# EAGLE design STorM32 NT logger micro v22g4 000 (EAGLE 7.5.0)
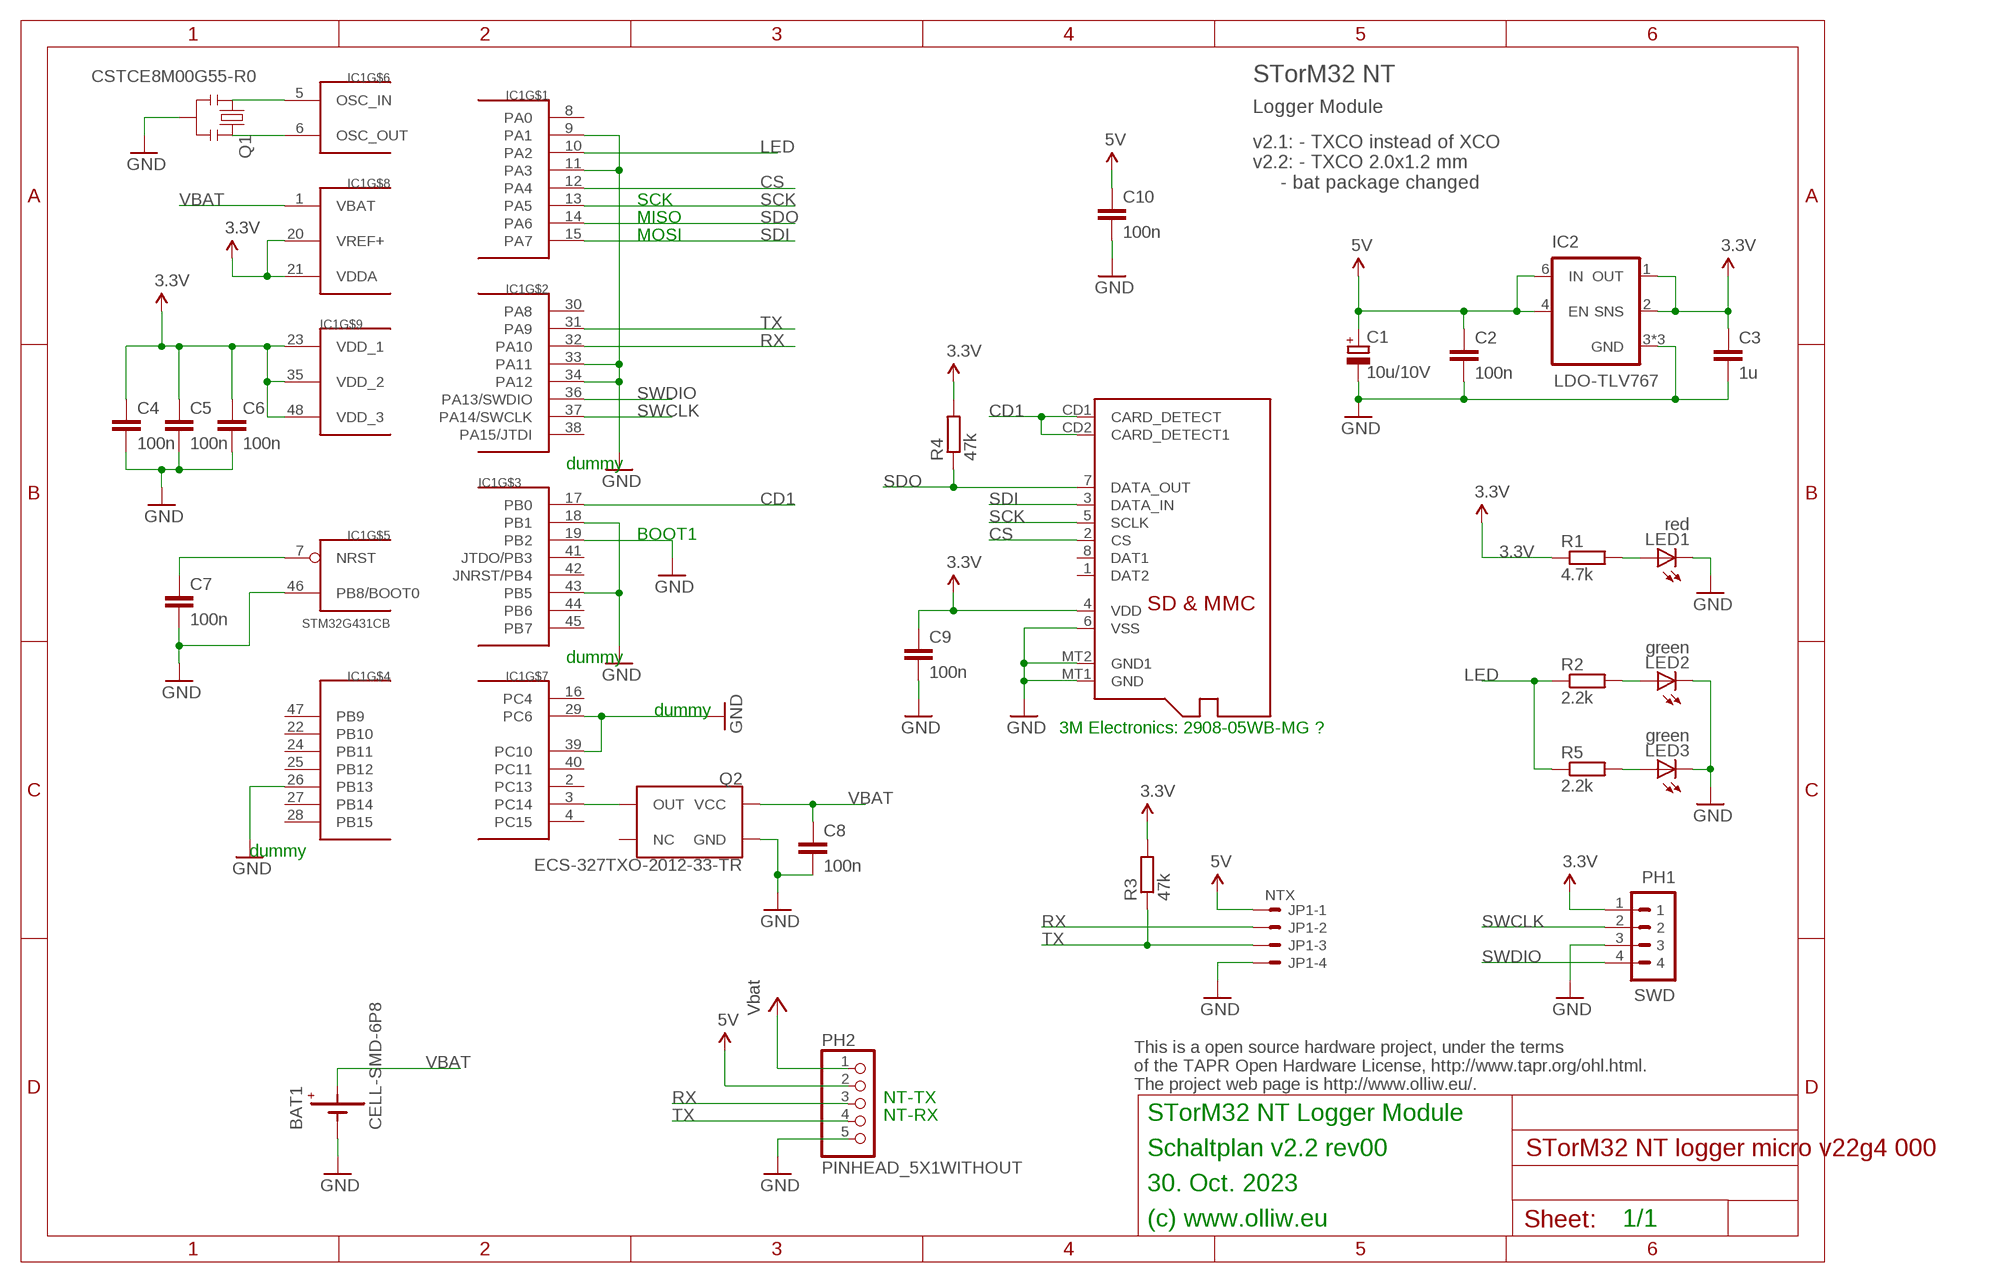
[diagram p0: schematic, sheet 1]

## Parts
BAT1  CELL-SMD-6P8  [CELL-RECHARGABLE-6P8]
C1  10u/10V  CPOL-EUSMCB  [SMC_B]
C2  100n  C-EUC0603  [C0603]
C3  1u  C-EUC0603  [C0603]
C4  100n  C-EUC0402  [C0402]
C5  100n  C-EUC0402  [C0402]
C6  100n  C-EUC0402  [C0402]
C7  100n  C-EUC0402  [C0402]
C8  100n  C-EUC0402  [C0402]
C9  100n  C-EUC0402  [C0402]
C10  100n  C-EUC0603  [C0603]
IC1  STM32G431CB  STM32G4X1CX  [UFQFPN48]
IC2  LDO-TLV767  [WSON-6-2X2]
JP1  NTX  SM04B-SRSS-TB  [SM04B-SRSS-TB]
LED1  red  LEDCHIPLED_0603  [CHIPLED_0603]
LED2  green  LEDCHIPLED_0603  [CHIPLED_0603]
LED3  green  LEDCHIPLED_0603  [CHIPLED_0603]
PH1  SWD  P4X1_1P27-OCT_BILEX  [4X1_1P27_OCT_BILEX]
PH2  PINHEAD_5X1WITHOUT  [PINHEAD_5X1_WO]
Q1  CSTCE8M00G55-R0  RESONATORSMD  [RESONATOR-SMD]
Q2  ECS-327TXO-2012-33-TR  TXCO-2.0X1.2MM  [TXCO-20X12]
R1  4.7k  R-EU_R0402  [R0402]
R2  2.2k  R-EU_R0402  [R0402]
R3  47k  R-EU_R0402  [R0402]
R4  47k  R-EU_R0402  [R0402]
R5  2.2k  R-EU_R0402  [R0402]
U1  3M 2908-05WB-MG ??  MICROSD  [MICROSD]

## Nets
3.3V: C3.1 C4.1 C5.1 C6.1 C9.1 IC1.20(VREF+) IC1.21(VDDA) IC1.23(VDD_1) IC1.35(VDD_2) IC1.48(VDD_3) IC2.1(OUT) IC2.2(SNS) PH1.1 R1.1 R3.2 R4.2 U1.4(VDD)
5V: C1.+ C2.1 C10.1 IC2.4(EN) IC2.6(IN) JP1.1 PH2.2
CD1: IC1.17(PB0) U1.CD1(CARD_DETECT) U1.CD2(CARD_DETECT1)
CS: IC1.12(PA4) U1.2(CS)
GND: BAT1.P-(GND) C1.- C2.2 C3.2 C4.2 C5.2 C6.2 C7.2 C8.2 C9.2 C10.2 IC1.9(PA1) IC1.11(PA3) IC1.18(PB1) IC1.19(PB2) IC1.26(PB13) IC1.29(PC6) IC1.33(PA11) IC1.34(PA12) IC1.39(PC10) IC1.43(PB5) IC1.46(PB8/BOOT0) IC2.3(GND) IC2.5(GND) IC2.7(GND) JP1.4 LED1.C LED2.C LED3.C PH1.3 PH2.5 Q1.2 Q2.2(GND) U1.6(VSS) U1.MT1(GND) U1.MT2(GND1)
LED: IC1.10(PA2) R2.1 R5.1
N$3: C7.1 IC1.7(NRST)
N$5: LED2.A R2.2
N$6: IC1.5(OSC_IN) Q1.1
N$7: IC1.6(OSC_OUT) Q1.3
N$8: IC1.3(PC14) Q2.3(OUT)
N$9: LED1.A R1.2
N$10: LED3.A R5.2
RX: IC1.32(PA10) JP1.2 PH2.3
SCK: IC1.13(PA5) U1.5(SCLK)
SDI: IC1.15(PA7) U1.3(DATA_IN)
SDO: IC1.14(PA6) R4.1 U1.7(DATA_OUT)
SWCLK: IC1.37(PA14/SWCLK) PH1.2
SWDIO: IC1.36(PA13/SWDIO) PH1.4
TX: IC1.31(PA9) JP1.3 PH2.4 R3.1
VBAT: BAT1.P+(BAT+) C8.1 IC1.1(VBAT) Q2.4(VCC)
VCC: PH2.1 ; supply symbol labelled Vbat
Unconnected: IC1.2(PC13) IC1.4(PC15) IC1.8(PA0) IC1.16(PC4) IC1.22(PB10) IC1.24(PB11) IC1.25(PB12) IC1.27(PB14) IC1.28(PB15) IC1.30(PA8) IC1.38(PA15/JTDI) IC1.40(PC11) IC1.41(JTDO/PB3) IC1.42(JNRST/PB4) IC1.44(PB6) IC1.45(PB7) IC1.47(PB9) Q2.1(NC) U1.1(DAT2) U1.8(DAT1)

## Notes on the sheet
- STorM32 NT
- Logger Module
- v2.1: - TXCO instead of XCO
  v2.2: - TXCO 2.0x1.2 mm
       - bat package changed
- SCK
- MISO
- MOSI
- dummy
- BOOT1
- dummy
- dummy
- 3M Electronics: 2908-05WB-MG ?
- dummy
- This is a open source hardware project, under the terms
  of the TAPR Open Hardware License, http://www.tapr.org/ohl.html.
  The project web page is http://www.olliw.eu/.
- NT-TX
- NT-RX | STorM32 NT Logger Module
- Schaltplan v2.2 rev00
- 30. Oct. 2023
- (c) www.olliw.eu | 1/1

## Library data of the parts
BAT1 = # stdlib:CELL
C1 = rcl:CPOL-EU: POLARIZED CAPACITOR, European symbol
C2-C10 = rcl:C-EU: CAPACITOR, European symbol
IC1 = # stm32:STM32G4X1CX
IC2 = # stdlib:LDO-TLV767
JP1 = con-jst2:?M04B-SRSS-TB: Disconnectable Crimp style connector, 1.0mm pitch 4 contacts
LED1-LED3 = led:LED: LED OSRAM: - CHIPLED LG R971, LG N971, LY N971, LG Q971, LY Q971, LO R971, LY R971 LH N974, LH R974 LS Q976, LO Q976, LY Q976 LO Q996 - Hyper CHIPLED LW Q18S LB Q993, LB Q99A, LB R99A - SideLED LS A670, LO A670, LY A670, LG A670, LP A670 LB A673, LV A673, LT A673, LW A673 LH A674 LY A675 LS A676, LA A676, LO A676, LY A676, LW A676 LS A679, LY A679, LG A679 - Hyper Micro SIDELED® LS Y876, LA Y876, LO Y876, LY Y876 LT Y87S - SmartLED LW L88C, LW L88S LB L89C, LB L89S, LG L890 LS L89K, LO L89K, LY L89K LS L896, LA L896, LO L896, LY L896 - TOPLED LS T670, LO T670, LY T670, LG T670, LP T670 LSG T670, LSP T670, LSY T670, LOP T670, LYG T670 LG T671, LOG T671, LSG T671 LB T673, LV T673, LT T673, LW T673 LH T674 LS T676, LA T676, LO T676, LY T676, LB T676, LH T676, LSB T676, LW T676 LB T67C, LV T67C, LT T67C, LS T67K, LO T67K, LY T67K, LW E67C LS E67B, LA E67B, LO E67B, LY E67B, LB E67C, LV E67C, LT E67C LW T67C LS T679, LY T679, LG T679 LS T770, LO T770, LY T770, LG T770, LP T770 LB T773, LV T773, LT T773, LW T773 LH T774 LS E675, LA E675, LY E675, LS T675 LS T776, LA T776, LO T776, LY T776, LB T776 LHGB T686 LT T68C, LB T68C - Hyper Mini TOPLED® LB M676 - Mini TOPLED Santana® LG M470 LS M47K, LO M47K, LY M47K Source: http://www.osram.convergy.de LUXEON: - LUMILED® LXK2-PW12-R00, LXK2-PW12-S00, LXK2-PW14-U00, LXK2-PW14-V00 LXK2-PM12-R00, LXK2-PM12-S00, LXK2-PM14-U00 LXK2-PE12-Q00, LXK2-PE12-R00, LXK2-PE12-S00, LXK2-PE14-T00, LXK2-PE14-U00 LXK2-PB12-K00, LXK2-PB12-L00, LXK2-PB12-M00, LXK2-PB14-N00, LXK2-PB14-P00, LXK2-PB14-Q00 LXK2-PR12-L00, LXK2-PR12-M00, LXK2-PR14-Q00, LXK2-PR14-R00 LXK2-PD12-Q00, LXK2-PD12-R00, LXK2-PD12-S00 LXK2-PH12-R00, LXK2-PH12-S00 LXK2-PL12-P00, LXK2-PL12-Q00, LXK2-PL12-R00 Source: www.luxeon.com KINGBRIGHT: KA-3528ASYC Source: www.kingbright.com
PH1 = # stdlib:P4X1_1P27
PH2 = # stdlib:PINHEAD_5X1
Q1 = # SparkFun2:RESONATOR: Resonator Small SMD resonator. This is the itty bitty 10/20MHz resonators with built in caps. CSTCE10M0G55 and CSTCE20M0V53. Footprint has been reviewed closely but hasn't been tested yet.
Q2 = # stdlib:TXCO
R1-R5 = rcl:R-EU_: RESISTOR, European symbol
U1 = # adafruit:MICROSD: Micro-SD / Transflash card holder with SPI pinout For the 3M # 2908-05WB-MG and/or 4UCON #19656 push-push type

## Board
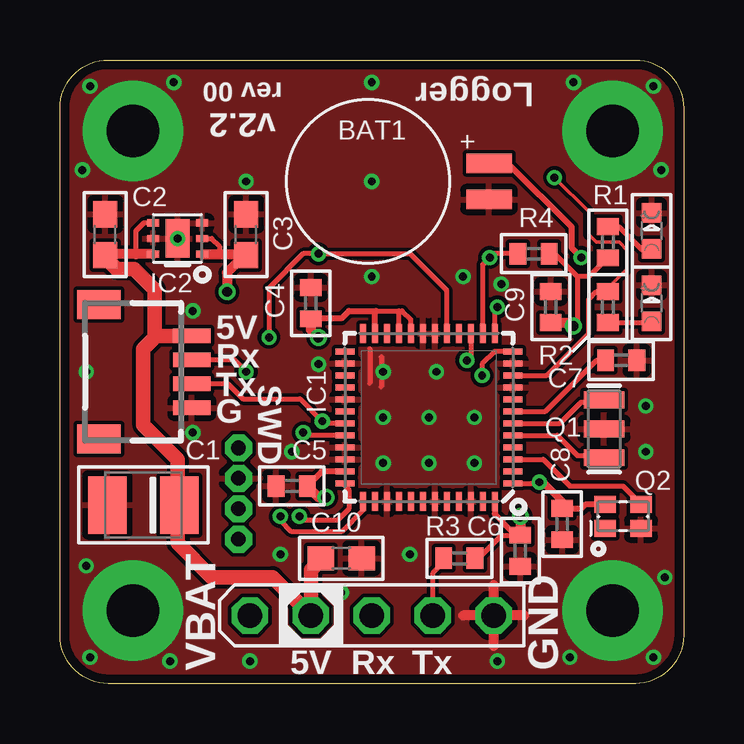
[diagram p1: board, top side]
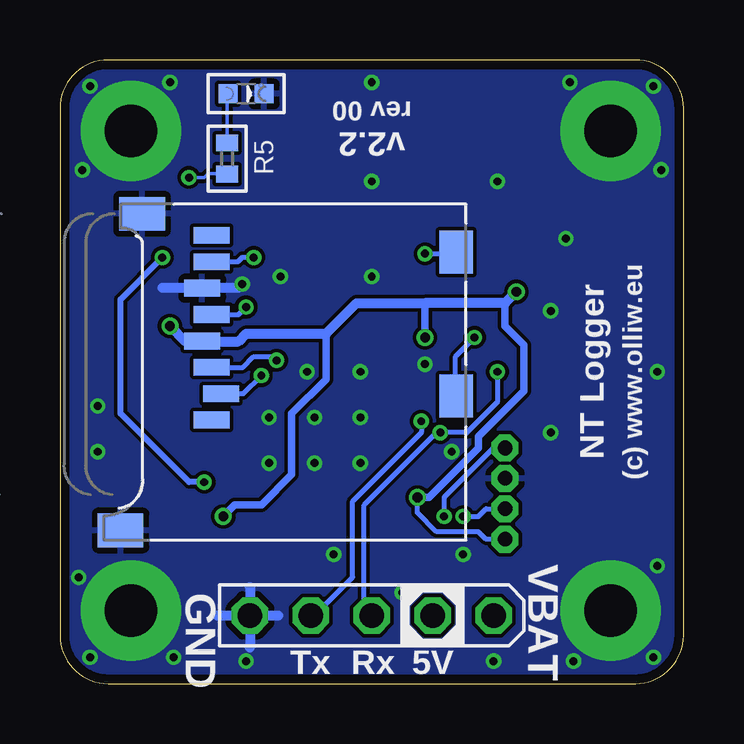
[diagram p2: board, bottom side, seen from below]

Size 26 x 26 mm. Coordinates in mm from the lower left corner, seen from the top.
Outline: 24,0 2,0 arc-90 0,2 0,24 arc-90 2,26 24,26 arc-90 26,24 26,2 arc-90 24,0
Copper layers (1*16): Top 0.035mm / dielectric 1.5mm / Bottom 0.035mm
Design rules "ShenZhen2U_2layer_EagleRules *": minimum track width 6mil, minimum drill 12mil, track to track 6mil, track to pad 6mil, pad to pad 6mil, via to via 6mil, smd to smd 0mil, copper to edge 15mil, drill to drill 10mil, minimum pad ring 10mil, minimum via ring 6mil, stop-mask expansion 2mil, vias tented up to drill 25mil, thermal gap 10mil

### Footprints (pad centres in the part's own frame; a part is rotated, then mirrored left to right if it is on the bottom)
CELL-RECHARGABLE-6P8 = smd 1.9 x 0.8: P+ 5.05,0.75; P- 5.05,-0.75
SMC_B = smd 1.6 x 2.4: + -1.5,0; - 1.5,0
C0603 = smd 1.1 x 1: 1 -0.85,0; 2 0.85,0
C0402 = smd 0.7 x 0.9: 1 -0.65,0; 2 0.65,0
UFQFPN48 = smd 0.8 x 0.25: 1 -3.5,2.75; 2 -3.5,2.25; 3 -3.5,1.75; 4 -3.5,1.25; 5 -3.5,0.75; 6 -3.5,0.25; 7 -3.5,-0.25; 8 -3.5,-0.75; 9 -3.5,-1.25; 10 -3.5,-1.75; 11 -3.5,-2.25; 12 -3.5,-2.75; 25 3.5,-2.75; 26 3.5,-2.25; 27 3.5,-1.75; 28 3.5,-1.25; 29 3.5,-0.75; 30 3.5,-0.25; 31 3.5,0.25; 32 3.5,0.75; 33 3.5,1.25; 34 3.5,1.75; 35 3.5,2.25; 36 3.5,2.75 | smd 0.25 x 0.8: 13 -2.75,-3.5; 14 -2.25,-3.5; 15 -1.75,-3.5; 16 -1.25,-3.5; 17 -0.75,-3.5; 18 -0.25,-3.5; 19 0.25,-3.5; 20 0.75,-3.5; 21 1.25,-3.5; 22 1.75,-3.5; 23 2.25,-3.5; 24 2.75,-3.5; 37 2.75,3.5; 38 2.25,3.5; 39 1.75,3.5; 40 1.25,3.5; 41 0.75,3.5; 42 0.25,3.5; 43 -0.25,3.5; 44 -0.75,3.5; 45 -1.25,3.5; 46 -1.75,3.5; 47 -2.25,3.5; 48 -2.75,3.5
WSON-6-2X2 = smd 0.5 x 0.3: 1 -1.025,0.65; 2 -1.025,0; 3 -1.025,-0.65; 4 1.025,-0.65; 5 1.025,0; 6 1.025,0.65 | smd 1 x 1.6: 7 0,0
SM04B-SRSS-TB = smd 0.6 x 1.55: 1 -1.5,2.975; 2 -0.5,2.975; 3 0.5,2.975; 4 1.5,2.975 | smd 1.2 x 1.8: FIT@1 -2.8,-0.9; FIT@2 2.8,-0.9
CHIPLED_0603 = smd 0.8 x 0.8: A 0,-0.75; C 0,0.75
4X1_1P27_OCT_BILEX = drill 0.61 pad 1.118 octagon: 1 0,0; 2 0,-1.27; 3 0,-2.54; 4 0,-3.81
PINHEAD_5X1_WO = drill 1.016 octagon: 1 0,0; 2 0,-2.54; 3 0,-5.08; 4 0,-7.62; 5 0,-10.16
RESONATOR-SMD = smd 0.7 x 1.7: 1 -1.2,0; 2 0,0; 3 1.2,0
TXCO-20X12 = smd 0.7 x 0.9: 1 -0.5,0.75; 2 -0.5,-0.75; 3 0.5,-0.75; 4 0.5,0.75
R0402 = smd 0.7 x 0.9: 1 -0.65,0; 2 0.65,0
MICROSD = smd 0.7 x 1.5: 1 9,-10.64; 2 7.9,-10.24; 3 6.8,-10.64; 4 5.7,-11.04; 5 4.6,-10.64; 6 3.5,-11.04; 7 2.4,-10.64; 8 1.3,-10.64 | smd 1.8 x 1.4: CD1 2,-0.44; CD2 8,-0.44 | smd 1.4 x 1.9: MT1 0.4,-13.54; MT2 13.6,-14.44

### Placement (x,y rotation side)
BAT1  12.84,20.94 0 top
C1  3.47,7.44 180 top
C2  1.89,18.71 90 top
C3  7.76,18.71 90 top
C4  10.46,15.86 90 top
C5  9.67,8.24 180 top
C6  19.19,5.54 270 top
C7  23.4,13.48 0 top
C8  20.94,6.65 270 top
C9  20.46,15.7 90 top
C10  11.73,5.22 0 top
IC1  15.38,11.1 180 top
IC2  4.9,18.56 180 top
JP1  2.52,13 270 top
LED1  24.67,18.87 0 top
LED2  24.67,15.86 0 top
LED3  18.24,24.59 270 bottom
PH1  7.44,6.02 180 top
PH2  7.92,2.84 90 top
Q1  22.68,10.62 90 top
Q2  23.48,6.97 90 top
R1  22.84,18.4 90 top
R2  22.84,15.7 270 top
R3  16.65,5.22 0 top
R4  19.75,17.92 0 top
R5  19.03,21.89 90 bottom
U1  9.03,19.98 270 bottom

### Tracks (layer width: path | path; a pad name or v marks a point on that pad's centre or on a via)
3.3V  (via drill 0.4)
  Top 0.203: 13.16,15.54 14.13,15.54 | 14.13,15.54 14.27,15.54 14.63,15.18 IC1.20 | IC1.21 14.13,15.54 | 21.57,16.97 21.57,14.9 v21.41,14.9 | R4.2 20.62,17.92 21.57,16.97 | R1.1 22.83,17.75 22.05,16.97 21.57,16.97 | IC2.2 6.33,18.56 6.65,18.24 6.65,17.91 | R3.2 17.45,5.22 18.4,6.17 19.18,6.17 C6.1
  Top 0.254: C4.1 10.45,15.22 11.73,15.22 12.05,15.54 13.16,15.54 13.13,15.51 IC1.23 | IC1.35 10.92,8.85 C5.1 | IC1.48 18.13,7.07 18.87,6.33 19.05,6.33 C6.1
  Top 0.305: 19.19,6.03 C6.1
  Top 0.406: v10.78,14.43 10.46,14.75 C4.1 | C5.1 10.47,8.06 10.78,7.76 v11.1,7.76 | C9.1 21.27,15.05 v21.41,14.9 | IC2.1 6.65,17.91 7.88,17.91 C3.1 7.6,17.76 6.97,17.13 v6.97,16.33 | v19.19,6.97 C6.1
  Bottom 0.152: 20.09,14.27 U1.4
  Bottom 0.203: PH1.1 8.24,6.02 8.55,6.33 10.3,6.33 11.1,7.13 v11.1,7.76
  Bottom 0.305: 10.78,15.86 v10.78,14.43 | 7.44,15.86 7.44,14.9 6.65,14.11 6.65,12.21 8.55,10.3 8.55,9.82 10.62,7.76 v11.1,7.76 | v19.19,6.97 18.71,7.44 17.6,7.44 16.33,8.71 16.33,11.25 14.9,12.68 14.9,14.59
  Bottom 0.406: v21.41,14.9 20.78,14.27 20.09,14.27 18.56,14.27 18.24,14.59 14.9,14.59 13.63,15.86 10.78,15.86 7.44,15.86 v6.97,16.33
5V
  Top 0.203: IC2.4 3.49,19.21 3.16,18.87 3.16,17.91
  Top 0.406: IC2.6 3.16,17.91 1.93,17.91 C2.1
  Top 0.61: C10.1 10.88,5.17 10.46,4.75 PH2.2 8.87,4.43 6.33,4.43 4.9,5.86 4.9,7.37 C1.+ 4.9,7.52 4.9,9.35 3.47,10.78 3.47,13.95 3.95,14.43 | 3.95,14.43 3.95,16.44 3.1,17.29 2.36,17.29 1.89,17.76 C2.1 | JP1.1 4.04,14.5 3.95,14.43
CD1  (via drill 0.33)
  Top 0.203: IC1.17 16.13,16.38 14.59,17.92 v10.78,17.92 10.14,17.92 8.71,16.49 v8.71,14.43
  Bottom 0.152: 9.51,12.02 U1.CD2
  Bottom 0.203: 9.51,12.02 9.51,13.63 v8.71,14.43 | v10.78,17.92 9.54,17.92 U1.CD1
CS  (via drill 0.33)
  Top 0.203: IC1.12 18.13,13.85 17.6,13.32 v17.6,12.84
  Bottom 0.203: U1.2 18.36,12.08 v17.6,12.84
GND  (via drill 0.33, 2.2 pad 4.2)
  Top 0.203: 13.4,13.63 13.4,12.37 | 12.92,13.95 12.92,12.52
  Top 0.406: 19.35,2.84 16.81,2.84 | 18.08,4.11 18.08,1.57
  Bottom 0.406: 19.43,2.84 16.89,2.84 | 18.08,4.03 18.08,1.49 | 18.56,16.49 21.73,16.49
  other vias: 3.04,3.04 23.04,3.04 3.04,23.04 23.04,23.04 11.73,3.79 13.48,11.1 17.29,11.1 15.38,9.19 13.48,9.19 13,25.06 1.09,13 9.67,9.67 14.59,5.38 1.25,1.09 1.09,4.9 4.59,0.93 24.75,1.09 25.22,4.43 21.26,1.09 1.25,24.91 4.75,25.06 0.93,21.41 24.75,24.91 21.41,25.06 25.06,21.41 7.92,0.93 18.24,0.93 13.48,13 15.38,11.1 17.29,9.19 15.7,13 9.19,5.38 13,20.94 13,16.97 10.78,13.32 16.81,16.97 24.43,11.57 7.76,20.94 4.9,18.56 18.4,16.65 24.43,9.67 5.54,15.54 5.54,10.46
  pour Top (isolate 0.152, rank 6): -0.02,-0.02 -0.02,26.02 26.02,26.02 26.02,-0.02
  pour Bottom (isolate 0.152, rank 6): -0.02,-0.02 -0.02,26.02 26.02,26.02 26.02,-0.02
LED  (via drill 0.33)
  Top 0.152: v20.62,21.1 22.05,19.67 22.05,18.71 22.37,18.4 23.32,18.4 23.64,18.08 23.64,17.29 22.84,16.49 R2.1
  Top 0.203: IC1.10 20.31,12.85 22.05,14.59 22.05,16.02 22.37,16.33 22.83,16.33 R2.1
  Bottom 0.152: v20.62,21.1 19.98,21.1 19.83,21.26 19.21,21.26 R5.1
N$3
  Top 0.203: IC1.7 20.23,11.35 22.37,13.48 C7.1
N$5
  Top 0.203: R2.2 24.69,15.05 LED2.A
N$6
  Top 0.203: IC1.5 20.73,10.35 21.57,9.51 22.44,9.51 Q1.1
N$7
  Top 0.203: IC1.6 20.85,10.85 21.73,11.73 22.91,11.73 Q1.3
N$8
  Top 0.203: IC1.3 20.15,9.35 21.26,8.24 23.48,8.24 24.11,7.6 24.27,7.6 Q2.3
N$9
  Top 0.152: LED1.A 24.91,18.08
  Top 0.203: R1.2 22.86,19.03 23.32,19.03 24.27,18.08 24.91,18.08
N$10
  Bottom 0.152: LED3.A 19.03,24.59 R5.2
RX  (via drill 0.33)
  Top 0.203: JP1.2 7.26,13.5 v7.76,13 | IC1.32 10.26,10.35 v10.14,10.46
  Bottom 0.203: PH2.3 13.32,3.16 13.32,7.44 10.3,10.46 v10.14,10.46 9.03,10.46 7.76,11.73 v7.76,13
SCK  (via drill 0.33)
  Top 0.203: IC1.13 18.13,15.59 v18.24,15.7
  Bottom 0.203: U1.5 18.55,15.38 v18.24,15.7
SDI  (via drill 0.33)
  Top 0.203: IC1.15 17.13,13.64 v16.97,13.48
  Bottom 0.203: U1.3 18.37,13.19 17.92,13.63 17.13,13.63 v16.97,13.48
SDO  (via drill 0.33)
  Top 0.203: IC1.14 17.63,17.47 v17.92,17.76 18.08,17.92 R4.1
  Bottom 0.203: v17.92,17.76 18.4,17.76 18.58,17.59 U1.7
SWCLK  (via drill 0.33)
  Top 0.203: IC1.37 12.63,7.23 11.73,6.33 9.67,6.33 9.19,6.81 v9.19,6.97
  Bottom 0.203: v9.19,6.97 8.55,6.97 8.24,7.29 PH1.2
SWDIO  (via drill 0.33)
  Top 0.203: IC1.36 11.88,8.24 12.05,8.08 12.05,7.29 11.57,6.81 10.14,6.81 v9.98,6.97
  Bottom 0.203: PH1.4 7.92,9.82 9.98,7.76 v9.98,6.97
TX  (via drill 0.33)
  Top 0.203: IC1.31 11.03,10.85 v10.94,10.94 10.01,11.87 7.63,11.87 6.99,12.5 JP1.3 | R3.1 16,5.05 15.54,4.59 PH2.4
  Bottom 0.203: PH2.4 15.38,2.84 13.79,4.43 13.79,7.6 10.94,10.46 v10.94,10.94
VBAT  (via drill 0.33)
  Top 0.203: IC1.1 19.93,8.35 v19.98,8.4 | 20.95,7.29 C8.1
  Top 0.254: v21.73,17.76 21.33,18.16 21.33,19.03 18.68,21.69 BAT1.P+ | Q2.4 21.91,7.47 21.73,7.29 20.95,7.29
  Top 0.305: BAT1.P+ 17.72,21.69 17.76,21.73 | C8.1 20.94,7.6 20.14,8.4 v19.98,8.4
  Bottom 0.254: v19.98,8.4 20.62,8.4 23.48,11.25 23.48,16.02 v21.73,17.76

### Text on the board
tNames: rev 00 | Logger | v2.2 | 5V | Rx | Tx | G | SWD | VBAT | 5V | Rx | Tx | GND
bNames: rev 00 | v2.2 | (c) www.olliw.eu | NT Logger | VBAT | GND | 5V | Rx | Tx